# Altium schematic sheet Connector.SchDoc
size A4
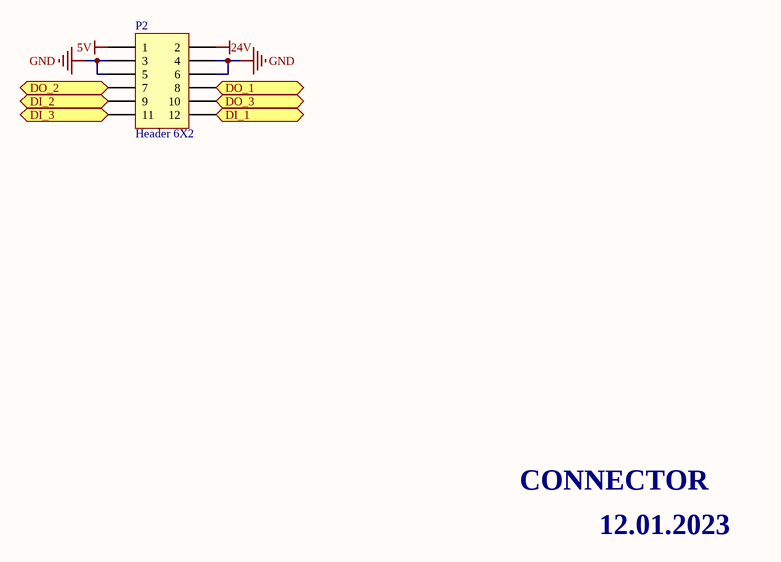
[diagram p0: Connector.SchDoc]

## Parts
P2  Header 6X2  [HDR2X6]

## Ports
DI_1, DI_2, DI_3, DO_1, DO_2, DO_3

## Nets
5V: P2.1
24V: P2.2
GND: P2.3 P2.4 P2.5 P2.6
DI_1: P2.12 ; port DI_1
DI_2: P2.9 ; port DI_2
DI_3: P2.11 ; port DI_3
DO_1: P2.8 ; port DO_1
DO_2: P2.7 ; port DO_2
DO_3: P2.10 ; port DO_3

## Notes on the sheet
- CONNECTOR
- 12.01.2023

## Library data of the parts
P2 = Header 6X2: CONNECTOR Header, 6-Pin, Dual row; LatestRevisionDate: 17-Jul-2002; LatestRevisionNote: Re-released for DXP Platform.; Publisher: Altium Limited